# EAGLE design FX-Devcart_rev_A (EAGLE 9.6.2)
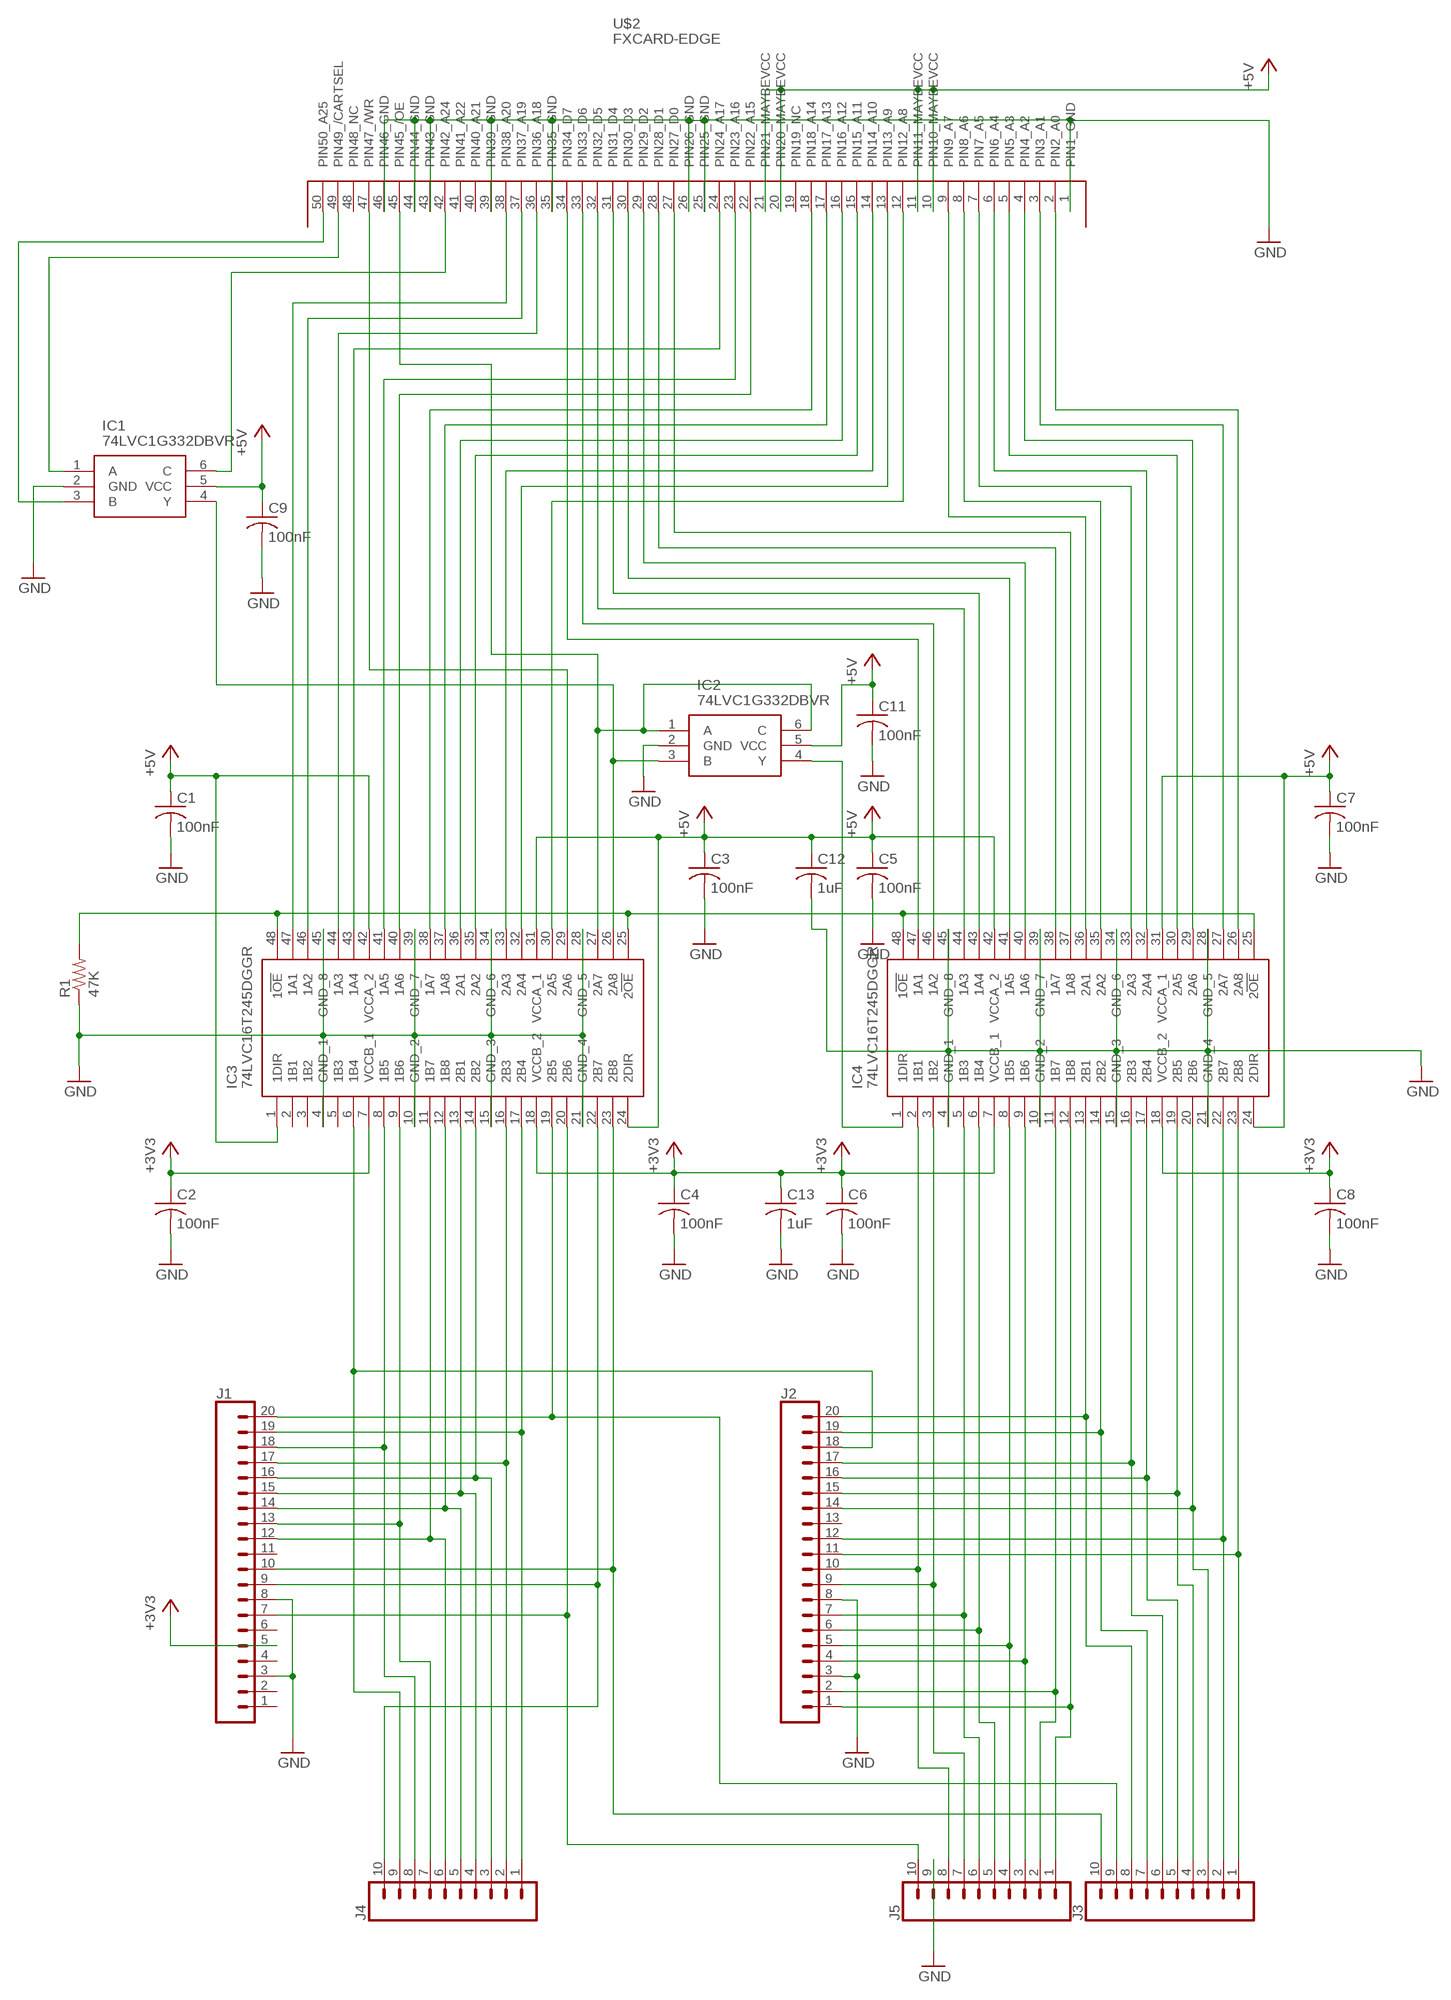
[diagram p0: schematic, sheet 1]

## Parts
C1  100nF  C-USC0402  [C0402]
C2  100nF  C-USC0402  [C0402]
C3  100nF  C-USC0402  [C0402]
C4  100nF  C-USC0402  [C0402]
C5  100nF  C-USC0402  [C0402]
C6  100nF  C-USC0402  [C0402]
C7  100nF  C-USC0402  [C0402]
C8  100nF  C-USC0402  [C0402]
C9  100nF  C-USC0402  [C0402]
C11  100nF  C-USC0402  [C0402]
C12  1uF  C-USC0402  [C0402]
C13  1uF  C-USC0402  [C0402]
IC1  74LVC1G332DBVR  [SOT95P280X145-6N]
IC2  74LVC1G332DBVR  [SOT95P280X145-6N]
IC3  74LVC16T245DGGR  [SOP50P810X120-48N]
IC4  74LVC16T245DGGR  [SOP50P810X120-48N]
J1  CONN_20NOSILK  [1X20_NOSILK]
J2  CONN_20NOSILK  [1X20_NOSILK]
J3  CONN_10NO_SILK_PTH_FEMALE  [1X10_NO_SILK]
J4  CONN_10NO_SILK_PTH_FEMALE  [1X10_NO_SILK]
J5  CONN_10NO_SILK_PTH_FEMALE  [1X10_NO_SILK]
R1  47K  R-US_R0402  [R0402]
U$2  FXCARD-EDGE  [FXCARD-EDGE]

## Nets
+3V3: C2.1 C4.1 C6.1 C8.1 C13.1 IC3.7(VCCB_1) IC3.18(VCCB_2) IC4.7(VCCB_1) IC4.18(VCCB_2) J1.5
+5V: C1.1 C3.1 C5.1 C7.1 C9.1 C11.1 C12.1 IC1.5(VCC) IC2.5(VCC) IC3.1(1DIR) IC3.24(2DIR) IC3.31(VCCA_1) IC3.42(VCCA_2) IC4.24(2DIR) IC4.31(VCCA_1) IC4.42(VCCA_2) U$2.10(PIN10_MAYBEVCC) U$2.11(PIN11_MAYBEVCC) U$2.20(PIN20_MAYBEVCC) U$2.21(PIN21_MAYBEVCC)
GND: C1.2 C2.2 C3.2 C4.2 C5.2 C6.2 C7.2 C8.2 C9.2 C11.2 C12.2 C13.2 IC1.2(GND) IC2.2(GND) IC3.4(GND_1) IC3.10(GND_2) IC3.15(GND_3) IC3.21(GND_4) IC3.28(GND_5) IC3.34(GND_6) IC3.39(GND_7) IC3.45(GND_8) IC4.4(GND_1) IC4.10(GND_2) IC4.15(GND_3) IC4.21(GND_4) IC4.28(GND_5) IC4.34(GND_6) IC4.39(GND_7) IC4.45(GND_8) J1.3 J1.8 J2.3 J2.8 J5.9 R1.1 U$2.1(PIN1_GND) U$2.25(PIN25_GND) U$2.26(PIN26_GND) U$2.35(PIN35_GND) U$2.39(PIN39_GND) U$2.43(PIN43_GND) U$2.44(PIN44_GND) U$2.46(PIN46_GND)
N$1: IC4.37(1A8) U$2.27(PIN27_D0)
N$2: IC4.38(1A7) U$2.28(PIN28_D1)
N$3: IC4.40(1A6) U$2.29(PIN29_D2)
N$4: IC4.41(1A5) U$2.30(PIN30_D3)
N$5: IC4.43(1A4) U$2.31(PIN31_D4)
N$6: IC4.44(1A3) U$2.32(PIN32_D5)
N$7: IC4.46(1A2) U$2.33(PIN33_D6)
N$8: IC4.47(1A1) U$2.34(PIN34_D7)
N$9: IC4.26(2A8) U$2.2(PIN2_A0)
N$10: IC4.27(2A7) U$2.3(PIN3_A1)
N$11: IC4.29(2A6) U$2.4(PIN4_A2)
N$12: IC4.30(2A5) U$2.5(PIN5_A3)
N$13: IC4.33(2A3) U$2.7(PIN7_A5)
N$14: IC3.43(1A4) U$2.24(PIN24_A17)
N$15: IC4.35(2A2) U$2.8(PIN8_A6)
N$16: IC4.36(2A1) U$2.9(PIN9_A7)
N$17: IC4.32(2A4) U$2.6(PIN6_A4)
N$18: IC3.44(1A3) U$2.36(PIN36_A18)
N$19: IC3.46(1A2) U$2.37(PIN37_A19)
N$20: IC3.47(1A1) U$2.38(PIN38_A20)
N$21: IC1.4(Y) IC2.3(B) IC3.26(2A8)
N$22: IC3.25(2!OE) IC3.48(1!OE) IC4.25(2!OE) IC4.48(1!OE) R1.2
N$23: IC4.23(2B8) J2.11 J3.1
N$24: IC4.22(2B7) J2.12 J3.2
N$25: IC4.20(2B6) J2.14 J3.3
N$26: IC2.4(Y) IC4.1(1DIR)
N$27: IC4.19(2B5) J2.15 J3.4
N$28: IC4.17(2B4) J2.16 J3.5
N$29: IC4.16(2B3) J2.17 J3.6
N$30: IC4.14(2B2) J2.19 J3.7
N$31: IC4.13(2B1) J2.20 J3.8
N$32: IC4.12(1B8) J2.1 J5.1
N$33: IC3.30(2A5) U$2.12(PIN12_A8)
N$34: IC3.32(2A4) U$2.13(PIN13_A9)
N$35: IC3.33(2A3) U$2.14(PIN14_A10)
N$36: IC3.35(2A2) U$2.15(PIN15_A11)
N$37: IC3.36(2A1) U$2.16(PIN16_A12)
N$38: IC3.37(1A8) U$2.17(PIN17_A13)
N$39: IC3.38(1A7) U$2.18(PIN18_A14)
N$40: IC3.40(1A6) U$2.22(PIN22_A15)
N$41: IC3.41(1A5) U$2.23(PIN23_A16)
N$42: IC3.29(2A6) U$2.47(PIN47_/WR)
N$43: IC2.1(A) IC2.6(C) IC3.27(2A7) U$2.45(PIN45_/OE)
N$44: IC1.3(B) U$2.50(PIN50_A25)
N$45: IC1.1(A) U$2.49(PIN49_/CARTSEL)
N$46: IC1.6(C) U$2.42(PIN42_A24)
N$47: IC4.11(1B7) J2.2 J5.2
N$48: IC4.9(1B6) J2.4 J5.3
N$49: IC4.8(1B5) J2.5 J5.4
N$50: IC4.6(1B4) J2.6 J5.5
N$51: IC4.5(1B3) J2.7 J5.6
N$52: IC4.3(1B2) J2.9 J5.7
N$53: IC3.20(2B6) J1.7 J5.10
N$54: IC3.19(2B5) J1.20 J3.9
N$55: IC3.17(2B4) J1.19 J4.1
N$56: IC3.16(2B3) J1.17 J4.2
N$57: IC3.14(2B2) J1.16 J4.3
N$58: IC3.13(2B1) J1.15 J4.4
N$59: IC3.12(1B8) J1.14 J4.5
N$60: IC3.11(1B7) J1.12 J4.6
N$61: IC3.9(1B6) J1.13 J4.7
N$62: IC3.8(1B5) J1.18 J4.8
N$63: IC3.6(1B4) J2.18 J4.9
N$65: IC3.22(2B7) J1.9 J4.10
N$70: IC3.23(2B8) J1.10 J3.10
N$71: IC4.2(1B1) J2.10 J5.8
Unconnected: IC3.2(1B1) IC3.3(1B2) IC3.5(1B3) J1.1 J1.2 J1.4 J1.6 J1.11 J2.13 U$2.19(PIN19_NC) U$2.40(PIN40_A21) U$2.41(PIN41_A22) U$2.48(PIN48_NC)

## Library data of the parts
C1-C9 C11-C13 = PC-Engine0402:C-US: CAPACITOR, American symbol
IC1 IC2 = PC-Engine:74LVC1G332DBVR: Texas Instruments 74LVC1G332DBVR, 3-Input OR Logic Gate, 1.65 5.5 V, 6-Pin SOT-23 Source: Datasheet <http://www.ti.com/general/docs/suppproductinfo.tsp?distId=26&gotoUrl=http://www.ti.com/lit/gpn/sn74lvc1g332>; DESCRIPTION: Texas Instruments 74LVC1G332DBVR, 3-Input OR Logic Gate, 1.65 5.5 V, 6-Pin SOT-23; HEIGHT: 1.45mm; MANUFACTURER_NAME: Texas Instruments; MANUFACTURER_PART_NUMBER: 74LVC1G332DBVR
IC3 IC4 = PC-Engine:74LVC16T245DGGR: Texas Instruments 74LVC16T245DGGR, Dual, Bus Transceiver, 16-Bit Non-Inverting LVTTL, 1.65 5.5 V, 48-Pin TSSOP Source: Datasheet <https://www.ti.com/lit/ds/symlink/sn74lvc16t245.pdf?ts=1617777001037&ref_url=https%3A%2F%2Fwww.google.com%2F>; DESCRIPTION: Texas Instruments 74LVC16T245DGGR, Dual, Bus Transceiver, 16-Bit Non-Inverting LVTTL, 1.65 5.5 V, 48-Pin TSSOP; HEIGHT: 1.2mm; MANUFACTURER_NAME: Texas Instruments; MANUFACTURER_PART_NUMBER: 74LVC16T245DGGR
J1 J2 = SparkFun-Connectors:CONN_20: Multi connection point. Often used as Generic Header-pin footprint for 0.1 inch spaced/style header connections On any of the 0.1 inch spaced packages, you can populate with these: Break Away Headers - Straight <https://www.sparkfun.com/products/116> (PRT-00116) Break Away Male Headers - Right Angle <https://www.sparkfun.com/products/553> (PRT-00553) Female Headers <https://www.sparkfun.com/products/115> (PRT-00115) Break Away Headers - Machine Pin <https://www.sparkfun.com/products/117> (PRT-00117) Break Away Female Headers - Swiss Machine Pin <https://www.sparkfun.com/products/743> (PRT-00743) For SCREWTERMINALS and SPRING TERMINALS visit here: Screw Terimnals on SparkFun.com <https://www.sparkfun.com/search/results?term=Screw+Terminals> (5mm/3.5mm/2.54mm spacing) This device is also useful as a general connection point to wire up your design to another part of your project. Our various solder wires solder well into these plated through hole pads. Hook-Up Wire - Assortment (Stranded, 22 AWG) <https://www.sparkfun.com/products/11375> (PRT-11375) Hook-Up Wire - Assortment (Solid Core, 22 AWG) <https://www.sparkfun.com/products/11367> (PRT-11367) View the entire wire category on our website here <https://www.sparkfun.com/categories/141> Special notes: Molex polarized connector foot print use with SKU : PRT-08231 with associated crimp pins and housings. 1MM SMD Version SKU: PRT-10208 NOTES ON THE VARIANTS LOCK and LOCK_LONGPADS... This footprint was designed to help hold the alignment of a through-hole component (i.e. 6-pin header) while soldering it into place. You may notice that each hole has been shifted either up or down by 0.005 of an inch from it's more standard position (which is a perfectly straight line). This slight alteration caused the pins (the squares in the middle) to touch the edges of the holes. Because they are alternating, it causes a "brace" to hold the component in place. 0.005 has proven to be the perfect amount of "off-center" position when using our standard breakaway headers. Although looks a little odd when you look at the bare footprint, once you have a header in there, the alteration is very hard to notice. Also,if you push a header all the way into place, it is covered up entirely on the bottom side. Note about LOCK SPECIAL package: This is just like the LOCK variant in that the holes are staggared by 5 mil, but except for the last two holes. They are not altered from the "standard" footprint layout. This is used for a special purpose on the layout of our Graphic LCD Backpack. Make sure you want to use this device before selecting it for you project!
J3-J5 = SparkFun-Connectors_new:CONN_10: Multi connection point. Often used as Generic Header-pin footprint for 0.1 inch spaced/style header connections On any of the 0.1 inch spaced packages, you can populate with these: Break Away Headers - Straight <https://www.sparkfun.com/products/116> (PRT-00116) Break Away Male Headers - Right Angle <https://www.sparkfun.com/products/553> (PRT-00553) Female Headers <https://www.sparkfun.com/products/115> (PRT-00115) Break Away Headers - Machine Pin <https://www.sparkfun.com/products/117> (PRT-00117) Break Away Female Headers - Swiss Machine Pin <https://www.sparkfun.com/products/743> (PRT-00743) Arduino Stackable Header - 10 Pin <https://www.sparkfun.com/products/11376> (PRT-11376) For SCREWTERMINALS and SPRING TERMINALS visit here: Screw Terimnals on SparkFun.com <https://www.sparkfun.com/search/results?term=Screw+Terminals> (5mm/3.5mm/2.54mm spacing) This device is also useful as a general connection point to wire up your design to another part of your project. Our various solder wires solder well into these plated through hole pads. Hook-Up Wire - Assortment (Stranded, 22 AWG) <https://www.sparkfun.com/products/11375> (PRT-11375) Hook-Up Wire - Assortment (Solid Core, 22 AWG) <https://www.sparkfun.com/products/11367> (PRT-11367) View the entire wire category on our website here <https://www.sparkfun.com/categories/141> Special notes: Molex polarized connector foot print use with SKU : PRT-08231 with associated crimp pins and housings. 1MM SMD Version SKU: PRT-10208 NOTES ON THE VARIANTS LOCK and LOCK_LONGPADS... This footprint was designed to help hold the alignment of a through-hole component (i.e. 6-pin header) while soldering it into place. You may notice that each hole has been shifted either up or down by 0.005 of an inch from it's more standard position (which is a perfectly straight line). This slight alteration caused the pins (the squares in the middle) to touch the edges of the holes. Because they are alternating, it causes a "brace" to hold the component in place. 0.005 has proven to be the perfect amount of "off-center" position when using our standard breakaway headers. Although looks a little odd when you look at the bare footprint, once you have a header in there, the alteration is very hard to notice. Also,if you push a header all the way into place, it is covered up entirely on the bottom side.; PROD_ID: CONN-11563
R1 = PC-Engine0402:R-US_: RESISTOR, American symbol
U$2 = PC-Engine:FXCARD-EDGE

## Board
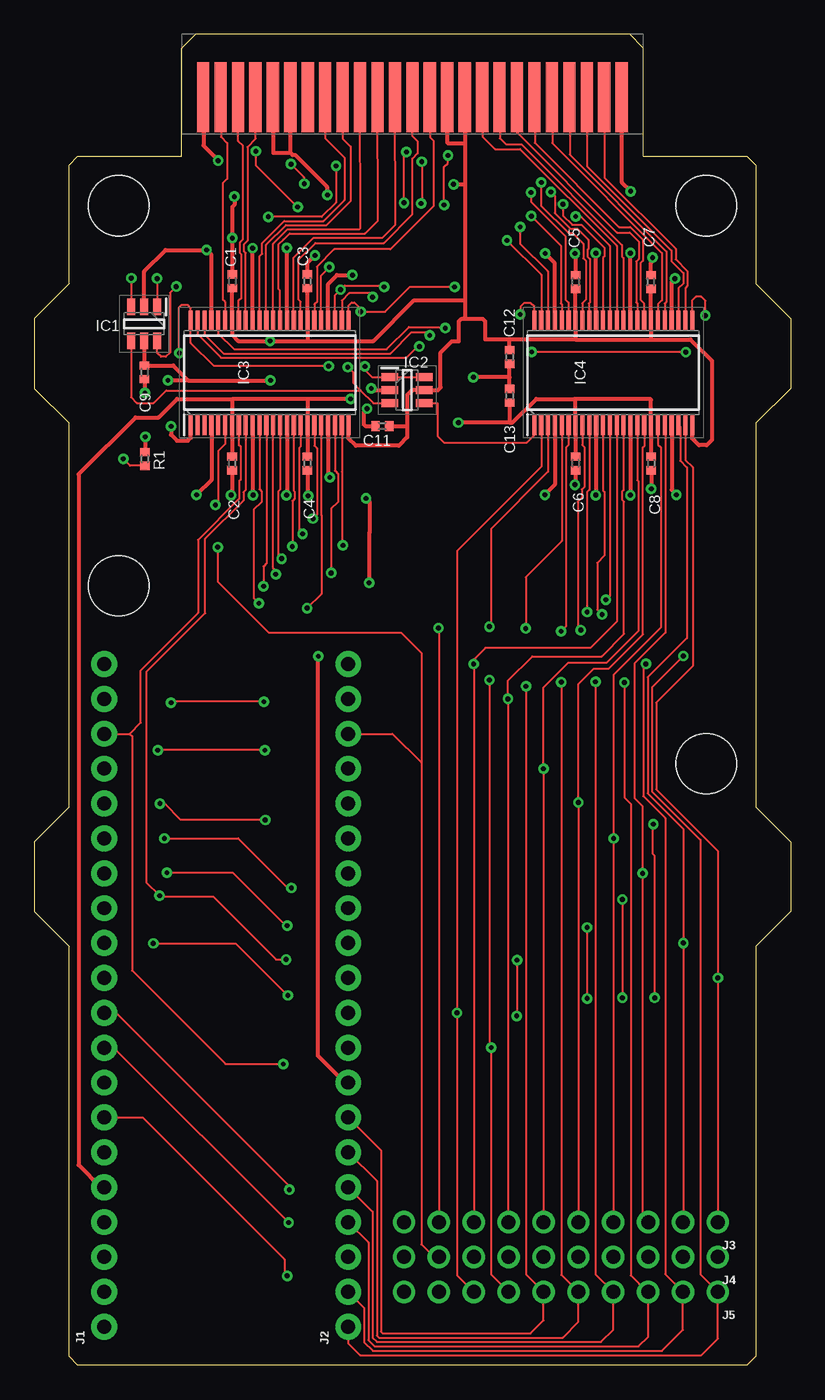
[diagram p1: board, top side]
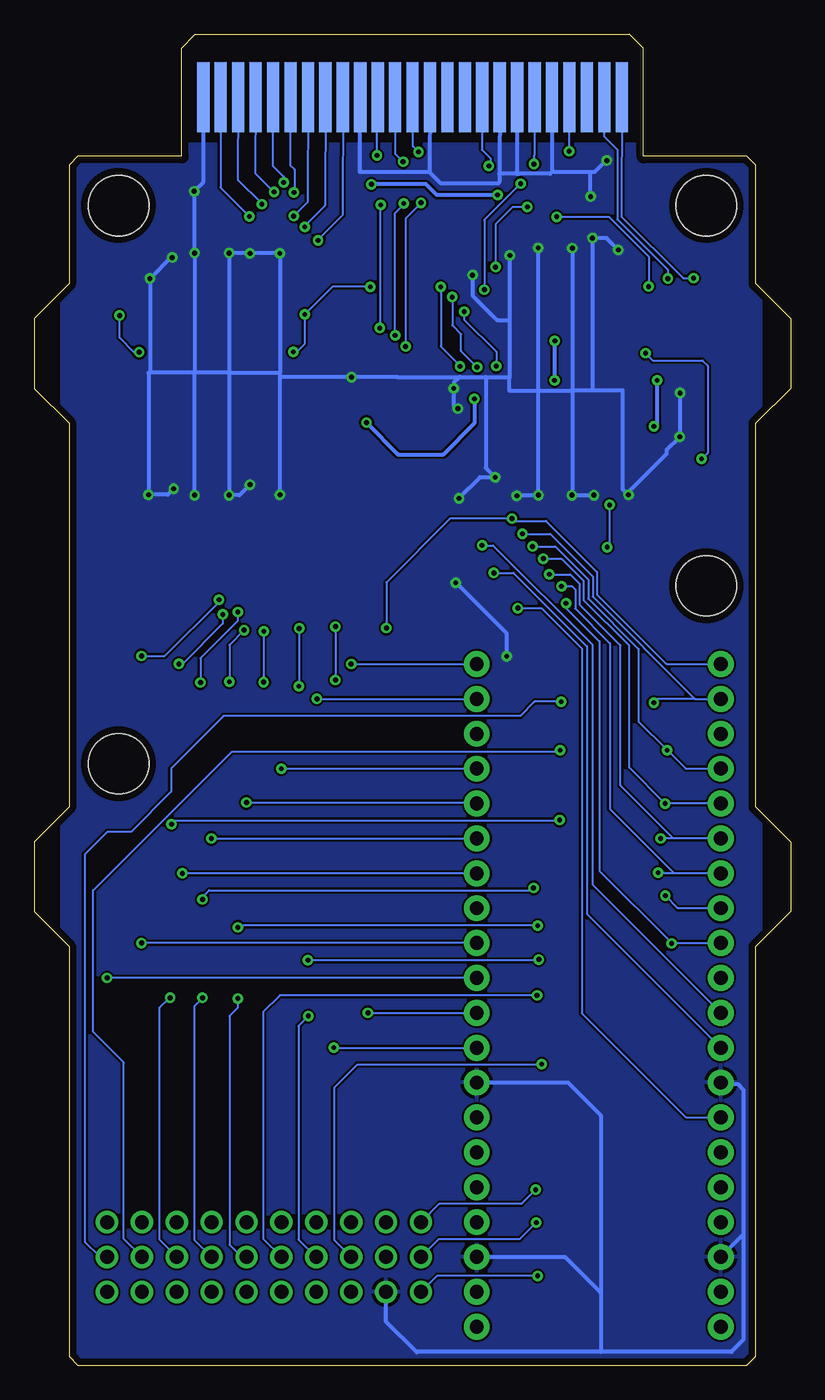
[diagram p2: board, bottom side, seen from below]

Size 55.08 x 96.9 mm. Coordinates in mm from the lower left corner, seen from the top.
Outline: 52.54,87.38 52.54,78.74 55.08,76.2 55.08,71.12 52.54,68.58 52.54,40.64 55.08,38.1 55.08,33.02 52.54,30.48 52.54,0.64 51.91,0 3.17,0 2.54,0.64 2.54,30.48 0,33.02 0,38.1 2.54,40.64 2.54,68.58 0,71.12 0,76.2 2.54,78.74 2.54,87.38 3.17,88.01 10.72,88.01 10.72,95.9 11.74,96.9 43.37,96.9 44.35,95.9 44.35,88.01 51.91,88.01 52.54,87.38
Copper layers (1*16): Top 0.035mm / dielectric 1.5mm / Bottom 0.035mm
Design rules "default *": minimum track width 6mil, minimum drill 0.35mm, track to track 6mil, track to pad 6mil, pad to pad 6mil, via to via 6mil, smd to smd 6mil, copper to edge 20mil, drill to drill 6mil, minimum pad ring 10mil, minimum via ring 8mil, stop-mask expansion 2mil, vias tented up to drill 15mil, thermal gap 10mil
Holes 4.4 mm at 6.14,84.43 48.94,84.43 6.14,56.74 48.94,43.79

### Footprints (pad centres in the part's own frame; a part is rotated, then mirrored left to right if it is on the bottom)
C0402 = smd 0.6 x 0.7: 1 -0.5,0; 2 0.5,0
SOT95P280X145-6N = smd 1.2 x 0.6: 1 -1.25,0.95; 2 -1.25,0; 3 -1.25,-0.95; 4 1.25,-0.95; 5 1.25,0; 6 1.25,0.95
SOP50P810X120-48N = smd 1.475 x 0.3: 1 -3.788,5.75; 2 -3.788,5.25; 3 -3.788,4.75; 4 -3.788,4.25; 5 -3.788,3.75; 6 -3.788,3.25; 7 -3.788,2.75; 8 -3.788,2.25; 9 -3.788,1.75; 10 -3.788,1.25; 11 -3.788,0.75; 12 -3.788,0.25; 13 -3.788,-0.25; 14 -3.788,-0.75; 15 -3.788,-1.25; 16 -3.788,-1.75; 17 -3.788,-2.25; 18 -3.788,-2.75; 19 -3.788,-3.25; 20 -3.788,-3.75; 21 -3.788,-4.25; 22 -3.788,-4.75; 23 -3.788,-5.25; 24 -3.788,-5.75; 25 3.788,-5.75; 26 3.788,-5.25; 27 3.788,-4.75; 28 3.788,-4.25; 29 3.788,-3.75; 30 3.788,-3.25; 31 3.788,-2.75; 32 3.788,-2.25; 33 3.788,-1.75; 34 3.788,-1.25; 35 3.788,-0.75; 36 3.788,-0.25; 37 3.788,0.25; 38 3.788,0.75; 39 3.788,1.25; 40 3.788,1.75; 41 3.788,2.25; 42 3.788,2.75; 43 3.788,3.25; 44 3.788,3.75; 45 3.788,4.25; 46 3.788,4.75; 47 3.788,5.25; 48 3.788,5.75
1X20_NOSILK = drill 1.016 pad 1.88: 1 0,0; 2 2.54,0; 3 5.08,0; 4 7.62,0; 5 10.16,0; 6 12.7,0; 7 15.24,0; 8 17.78,0; 9 20.32,0; 10 22.86,0; 11 25.4,0; 12 27.94,0; 13 30.48,0; 14 33.02,0; 15 35.56,0; 16 38.1,0; 17 40.64,0; 18 43.18,0; 19 45.72,0; 20 48.26,0
1X10_NO_SILK = drill 1.016 pad 1.626: 1 0,0; 2 2.54,0; 3 5.08,0; 4 7.62,0; 5 10.16,0; 6 12.7,0; 7 15.24,0; 8 17.78,0; 9 20.32,0; 10 22.86,0
R0402 = smd 0.6 x 0.7: 1 -0.5,0; 2 0.5,0
FXCARD-EDGE = smd 0.889 x 5.08: 1 32.055,-4.572; 2 30.785,-4.572; 3 29.515,-4.572; 4 28.245,-4.572; 5 26.975,-4.572; 6 25.705,-4.572; 7 24.435,-4.572; 8 23.165,-4.572; 9 21.895,-4.572; 10 20.625,-4.572; 11 19.355,-4.572; 12 18.085,-4.572; 13 16.815,-4.572; 14 15.545,-4.572; 15 14.275,-4.572; 16 13.005,-4.572; 17 11.735,-4.572; 18 10.465,-4.572; 19 9.195,-4.572; 20 7.925,-4.572; 21 6.655,-4.572; 22 5.385,-4.572; 23 4.115,-4.572; 24 2.845,-4.572; 25 1.575,-4.572 | smd 0.889 x 5.08 bottom: 26 32.055,-4.572; 27 30.785,-4.572; 28 29.515,-4.572; 29 28.245,-4.572; 30 26.975,-4.572; 31 25.705,-4.572; 32 24.435,-4.572; 33 23.165,-4.572; 34 21.895,-4.572; 35 20.625,-4.572; 36 19.355,-4.572; 37 18.085,-4.572; 38 16.815,-4.572; 39 15.545,-4.572; 40 14.275,-4.572; 41 13.005,-4.572; 42 11.735,-4.572; 43 10.465,-4.572; 44 9.195,-4.572; 45 7.925,-4.572; 46 6.655,-4.572; 47 5.385,-4.572; 48 4.115,-4.572; 49 2.845,-4.572; 50 1.575,-4.572

### Placement (x,y rotation side)
C1  14.43,78.92 90 top
C2  14.4,65.66 270 top
C3  19.89,78.92 90 top
C4  19.89,65.66 270 top
C5  39.42,78.87 90 top
C6  39.42,65.66 270 top
C7  44.91,78.87 90 top
C8  44.93,65.66 270 top
C9  8.03,72.29 270 top
C11  25.35,68.38 180 top
C12  34.62,73.41 270 top
C13  34.62,70.59 90 top
IC1  8,75.82 270 top
IC2  27.15,70.99 0 top
IC3  17.14,72.26 90 top
IC4  42.16,72.26 90 top
J1  5.08,2.79 90 top
J2  22.86,2.79 90 top
J3  49.78,10.41 180 top
J4  49.78,7.87 180 top
J5  49.78,5.33 180 top
R1  8.05,65.99 270 top
U$2  10.72,96.9 0 top

### Tracks (layer width: path | path; a pad name or v marks a point on that pad's centre or on a via)
+3V3  (via drill 0.35)
  Top 0.305: 34.62,68.63 34.82,68.63 36.55,70.36 39.37,70.36 39.38,70.35 | 39.38,70.35 44.84,70.35 44.91,70.28 IC4.18 44.91,66.18 C8.1 | 39.38,70.35 39.41,70.31 IC4.7 C6.1 | v23.04,70.36 19.96,70.36 | 34.62,68.63 v30.89,68.63 | 19.96,70.36 19.89,70.29 IC3.18 C4.1 | 19.96,70.36 14.45,70.36 | 14.45,70.36 14.39,70.3 IC3.7 C2.1 | C13.1 34.62,68.63 | J1.5 4.85,12.95 3.23,14.58 3.23,64.87 7.37,69.01 9.05,69.01 10.39,70.36 14.45,70.36
  Bottom 0.305: v30.89,68.63 28.57,66.32 25.3,66.32 23.04,68.58 v23.04,70.36
+5V  (via drill 0.35)
  Top 0.305: U$2.10 31.37,88.98 | 31.37,88.98 30.1,88.98 U$2.11 | U$2.21 17.4,88.27 18.67,88.27 | 18.67,88.27 U$2.20 | 19.89,74.57 v17.17,74.57 14.85,74.57 14.39,75.03 IC3.42 14.39,78.39 C1.1 | 19.89,74.57 24.69,74.57 27.66,77.55 31.37,77.55 | 31.27,76.2 31.11,76.2 30.93,76.01 30.93,74.55 30.4,74.55 29.59,73.74 29.59,71.2 29.39,70.99 IC2.5 27.51,70.99 27.15,70.64 27.15,68.38 | 31.27,76.2 32.64,76.2 32.83,76.01 32.83,74.68 34.62,74.68 | 39.41,74.68 IC4.42 C5.1 | 39.41,74.68 34.62,74.68 | 44.91,74.68 IC4.31 C7.1 | 39.41,74.68 44.91,74.68 | IC4.24 47.91,67.48 48.41,66.98 48.97,66.98 49.35,67.36 49.35,73.13 49.33,73.13 47.78,74.68 44.91,74.68 | 31.37,88.98 31.37,86.03 | 31.37,86.03 31.37,77.55 | 31.37,77.55 31.37,76.3 31.27,76.2 | C3.1 IC3.31 19.89,74.58 19.89,74.57 | IC1.5 8,72.81 C9.1 10.12,72.79 11.2,71.7 | 18.67,88.27 18.8,88.14 18.98,88.14 21.31,85.8 21.31,85.24 v21.35,85.2 | v30.53,85.98 31.32,85.98 31.37,86.03 | 11.2,71.7 v17.2,71.7 | C12.1 34.62,74.68 | IC3.24 22.89,67.48 23.42,66.95 26.54,66.95 27.15,67.56 27.15,68.38 | 11.2,71.7 9.91,71.7 v9.73,71.7 | v9.96,68.35 9.96,67.74 10.39,67.31 11.18,67.31 11.39,67.53 IC3.1 | C11.1 27.15,68.38
  Bottom 0.305: v21.35,85.2 25.77,85.2 26.57,86 30.5,86 v30.53,85.98 | v17.2,71.7 17.2,74.55 v17.17,74.57 | v9.73,71.7 9.73,68.58 v9.96,68.35
GND  (via drill 0.35)
  Top 0.305: v43.43,85.47 42.8,86.11 U$2.1 | U$2.25 12.32,88.8 13.39,87.73 v13.39,87.71 | IC4.21 46.41,63.72 v46.76,63.37 | IC4.15 v43.41,63.35 | IC4.45 37.91,80.23 v37.2,80.95 | IC4.39 40.91,80.95 v40.89,80.97 | IC4.34 v43.41,80.97 | IC4.28 46.41,78.88 v46.66,79.12 | IC4.4 37.91,64.11 37.19,63.38 37.18,63.38 v37.19,63.37 | IC4.10 40.91,63.37 v40.89,63.35 | C7.2 44.91,80.26 45.06,80.42 45.06,80.62 v45.03,80.64 | v39.37,80.95 39.42,80.9 C5.2 | v39.37,64.11 39.42,64.16 C6.2 | C8.2 v44.93,63.8 | IC3.28 21.39,78.72 22.05,79.38 v23.16,79.38 | IC3.21 21.39,64.76 v21.51,64.64 | IC3.15 18.39,63.38 v18.36,63.35 | IC3.34 v18.39,81.35 v18.39,81.36 | IC3.39 v15.89,81.33 v15.9,81.33 | IC3.10 15.89,63.38 v15.93,63.35 | IC3.4 12.89,64.46 v11.81,63.37 | IC3.45 12.89,80.86 v12.55,81.2 9.55,81.2 8,79.65 IC1.2 | C3.2 19.89,80.26 20.42,80.8 v20.45,80.8 | C1.2 v14.43,82.07 14.43,84.33 14.58,84.48 v14.58,85.08 v14.57,85.08 | v24.54,71.12 24.66,70.99 IC2.2 | C13.2 34.62,71.93 | 34.62,71.93 C12.2 | 34.62,71.93 v31.98,71.93 | C2.2 14.4,63.35 v14.32,63.35 | C4.2 19.89,63.35 v19.94,63.3 | C9.2 8.05,71.76 v8.05,70.79 | v8.08,67.59 8.08,66.52 R1.1 | v24.23,69.65 23.98,69.39 23.98,68.5 24.11,68.38 C11.2 | v24.16,63.12 24.41,62.87 24.41,60.6 24.38,60.58 v24.38,56.97 | v20.68,51.61 20.65,51.61 20.65,22.53 22.61,20.57 J2.8
  Bottom 0.305: U$2.39 26.29,86.87 | 26.29,86.87 31.37,86.87 U$2.35 | U$2.44 19.94,86.87 | 19.94,86.87 19.94,86.74 21.21,86.74 | U$2.43 21.21,86.74 | U$2.46 17.4,86.87 | 17.4,86.87 17.53,86.74 19.81,86.74 19.94,86.87 | U$2.1 42.8,86.11 v43.43,85.47 43.41,85.45 v43.41,80.97 43.41,72.26 | 40.92,72.26 40.89,72.26 v40.89,80.97 39.4,80.97 v39.37,80.95 v37.2,80.95 37.2,72.26 37.19,72.25 | 40.92,72.26 43.41,72.26 | 43.41,72.26 46.66,72.26 | 46.66,72.26 46.76,72.26 v46.76,63.37 45.36,63.37 v44.93,63.8 | 46.66,72.26 v46.66,79.12 45.09,80.7 v45.03,80.64 | 40.91,72.25 40.92,72.26 | v43.41,63.35 43.41,72.26 | 40.91,72.25 40.91,63.36 v40.89,63.35 40.13,63.35 v39.37,64.11 | 31.97,71.94 37.19,71.94 | 37.19,72.25 40.91,72.25 | v37.19,63.37 37.19,71.94 | 37.19,71.94 37.19,72.25 | 24.11,71.96 28.65,71.96 28.66,71.94 31.97,71.94 | 24.11,71.96 22.2,71.96 22.2,71.93 | 22.2,71.93 20.5,71.93 | 20.5,71.93 20.47,71.93 20.47,76.12 | 18.39,70.97 20.5,70.97 20.5,71.93 | 18.39,70.97 18.36,70.97 | 18.36,70.97 15.9,70.97 | 22.2,71.93 22.2,65.33 v21.51,64.64 22.63,64.64 v24.16,63.12 | 18.36,70.97 v18.36,63.35 19.89,63.35 v19.94,63.3 | v18.39,81.36 18.39,70.97 | v15.9,81.33 15.9,70.97 | 15.9,70.97 15.9,63.37 v15.93,63.35 v14.32,63.35 | 14.45,70.97 12.24,70.97 12.24,63.8 v11.81,63.37 11.81,63.58 9.04,66.34 9.04,66.62 v8.08,67.59 8.08,70.76 v8.05,70.79 | 14.45,70.97 15.9,70.97 | v20.45,80.8 20.47,80.77 20.47,76.12 | v23.16,79.38 23.16,77.88 21.39,76.1 20.5,76.1 20.47,76.12 | 14.45,70.97 14.45,82.04 v14.43,82.07 13.41,82.07 v12.55,81.2 | 24.11,71.96 24.54,71.53 v24.54,71.12 24.54,69.9 24.29,69.65 v24.23,69.65 | 21.21,86.74 21.21,86.13 21.31,86.03 25.45,86.03 26.29,86.87
  Bottom 0.305: v13.39,87.71 13.44,87.71 14.28,86.87 14.58,86.87 | 14.58,86.87 17.4,86.87 | v14.57,85.08 14.58,85.09 14.58,86.87 | J1.8 4.98,20.47 3.86,20.47 3.43,20.04 3.43,9.53 | J1.3 3.43,9.53 | 3.43,9.53 3.43,1.85 4.32,0.96 13.82,0.96 | J5.9 29.46,3.17 27.22,0.93 27.18,0.96 13.82,0.96 | J2.3 16.43,7.87 13.82,5.26 | 13.82,5.26 13.82,0.96 | J2.8 16.2,20.57 13.82,18.19 13.82,5.26 | v20.68,51.61 20.68,53.26 v24.38,56.97 | v31.98,71.93 31.97,71.94
  pour Bottom: 2.18,-0.2 2.18,88.39 1.7,88.87 52.68,88.87 53.09,88.47 53.09,0 52.98,-0.1 2.29,-0.1
N$1  (via drill 0.35)
  Top 0.152: v39.42,83.64 39.77,83.64 41.91,81.5 IC4.37
  Bottom 0.152: U$2.27 41.53,85.75 v39.42,83.64
N$2  (via drill 0.35)
  Top 0.152: v38.51,84.53 38.51,83.7 39.17,83.04 39.85,83.04 41.5,81.38 41.5,80.72 41.41,80.64 IC4.38
  Bottom 0.152: U$2.28 40.26,86.31 38.51,84.56 v38.51,84.53
N$3  (via drill 0.35)
  Top 0.152: v37.62,85.42 37.9,85.14 37.9,83.88 39.05,82.73 39.54,82.73 40.34,81.94 40.34,81.28 40.29,81.23 40.29,80.72 40.46,80.55 40.46,77.37 40.39,77.29 40.39,76.08 IC4.40
  Bottom 0.152: U$2.29 38.99,86.79 v37.62,85.42
N$4  (via drill 0.35)
  Top 0.152: IC4.41 39.91,77.33 40.16,77.57 40.16,80.42 39.98,80.6 39.98,81.66 39.21,82.43 38.92,82.43 36.91,84.44 36.91,86.11 v36.92,86.12
  Bottom 0.152: U$2.30 37.72,87.35 36.92,86.55 v36.92,86.12
N$5  (via drill 0.35)
  Top 0.152: v36.17,85.39 36.17,84.71 38.69,82.19 38.69,77.59 38.91,77.37 IC4.43
  Bottom 0.152: U$2.31 36.45,87.38 36.14,87.07 36.14,85.55 36.17,85.52 v36.17,85.39
N$6  (via drill 0.35)
  Top 0.152: v36.2,83.67 38.34,81.53 38.34,77.32 38.41,77.25 IC4.44
  Bottom 0.152: U$2.32 35.18,84.68 v36.2,83.67
N$7  (via drill 0.35)
  Top 0.152: v35.38,82.88 35.38,81.66 37.39,79.65 37.39,76.08 IC4.46
  Bottom 0.152: U$2.33 33.91,84.43 35.41,82.93 35.41,82.91 v35.38,82.88
N$8  (via drill 0.35)
  Top 0.152: v34.42,81.89 36.91,79.39 IC4.47
  Bottom 0.152: U$2.34 32.64,83.72 34.42,81.94 v34.42,81.89
N$9
  Top 0.152: IC4.26 47.41,78.44 47.57,78.59 47.57,79.65 46.71,80.52 46.71,81.28 41.53,86.46 U$2.2
N$10
  Top 0.152: U$2.3 40.26,87.3 46.41,81.15 46.41,80.39 47.27,79.53 47.27,78.77 46.91,78.41 IC4.27 | IC4.27
N$11
  Top 0.152: U$2.4 38.99,88.14 46.03,81.09 46.03,77.43 45.91,77.31 IC4.29
N$12
  Top 0.152: U$2.5 37.72,88.98 45.72,80.98 45.72,77.55 45.41,77.24 IC4.30
N$13
  Top 0.152: U$2.7 35.18,89.74 42.44,82.47 43.36,82.47 44.02,81.82 44.02,80.54 43.84,80.37 43.84,77.39 43.92,77.32 IC4.33
N$14
  Top 0.152: U$2.24 13.59,89.43 14.05,88.98 14.05,86.38 13.72,86.06 13.72,77.6 13.89,77.42 IC3.43
N$15
  Top 0.152: U$2.8 33.91,89.33 34.35,88.89 35.47,88.89 42.8,81.56 42.8,80.72 42.91,80.61 IC4.35
N$16
  Top 0.152: U$2.9 32.64,89.46 33.55,88.54 35.38,88.54 42.42,81.51 IC4.36
N$17
  Top 0.152: U$2.6 36.45,89 42.58,82.87 43.4,82.87 44.32,81.94 44.32,80.41 44.15,80.24 44.15,77.57 44.39,77.32 44.39,76.07 IC4.32
N$18  (via drill 0.35)
  Top 0.152: IC3.44 13.39,75.12 14.55,73.97 25.65,73.97 27.28,75.59 29.9,75.59 29.92,75.56 v29.92,75.52 | v29.84,84.48 29.84,87.25 30.12,87.53 v30.12,88.09
  Bottom 0.152: v29.92,75.52 29.9,75.54 29.9,84.43 v29.84,84.48 | v30.12,88.09 30.12,92.3 U$2.36
N$19  (via drill 0.35)
  Top 0.152: IC3.46 12.39,75.04 13.77,73.66 25.93,73.66 27.48,75.21 28.58,75.21 v28.8,74.98 | v28.17,84.59 28.22,84.64 v28.22,87.63
  Bottom 0.152: v28.8,74.98 28.8,83.9 28.17,84.53 v28.17,84.59 | v28.22,87.63 28.8,88.21 U$2.37
N$20  (via drill 0.35)
  Top 0.152: IC3.47 11.89,75.07 13.6,73.36 27.1,73.36 27.91,74.17 v28.04,74.17 | v26.92,84.63 26.92,88.34 v27.1,88.34
  Bottom 0.152: v28.04,74.17 28.04,83.49 26.92,84.61 v26.92,84.63 | v27.1,88.34 27.51,88.75 27.51,92.28 U$2.38
N$21  (via drill 0.35)
  Top 0.152: IC1.4 7.05,70.47 7.47,70.05 8.69,70.05 9.6,70.97 23.77,70.97 | 23.77,70.97 23.22,71.53 23.22,72.29 v22.84,72.67 | 23.77,70.97 24.7,70.04 IC2.3 | IC3.26 22.39,77.51 22.94,78.05 24.51,78.05 24.64,77.93 v24.64,77.78
  Bottom 0.152: v22.84,72.67 24,73.84 24,75.08 24.64,75.72 v24.64,77.78
N$22  (via drill 0.35)
  Top 0.152: IC3.25 22.89,77.15 23.11,77.37 23.32,77.37 23.77,76.91 v23.77,76.71 25.55,76.71 27.36,78.51 v30.61,78.51 | v21.44,72.75 13.08,72.75 11.39,74.43 IC3.48 11.39,76.97 11.2,77.17 10.69,77.17 10.52,76.99 10.52,73.74 v10.57,73.69 | IC4.48 36.41,77.07 36.14,77.34 35.66,77.34 35.41,77.09 35.41,76.53 v35.38,76.5 | v47.45,73.76 47.42,73.79 v36.22,73.79 | IC4.25 47.9,76.06 47.9,77.52 48.18,77.8 48.56,77.8 48.87,77.5 v48.87,76.43 | R1.2 6.98,65.49 v6.48,65.99
  Bottom 0.152: v23.77,76.71 23.77,76.12 21.44,73.79 v21.44,72.75 | v10.57,73.69 10.03,73.15 6.43,73.15 6.04,72.77 6.04,66.42 v6.48,65.99 | v36.22,73.79 35.94,73.79 35.38,74.35 v35.38,76.5 33.38,78.51 v30.61,78.51 | v47.45,73.76 47.83,73.76 48.87,74.8 v48.87,76.43
N$23  (via drill 0.35)
  Top 0.152: IC4.23 47.41,65.91 47.95,65.38 47.95,50.89 45.29,48.23 45.29,41.94 49.78,37.44 v49.78,28.19 J3.1
  Bottom 0.152: J2.11 v49.78,28.19
N$24  (via drill 0.35)
  Top 0.152: IC4.22 47.03,68.35 47.03,65.86 47.52,65.37 47.52,52.93 44.68,50.09 44.68,41.63 47.27,39.04 v47.27,30.73 47.27,10.44 J3.2
  Bottom 0.152: J2.12 v47.27,30.73
N$25  (via drill 0.35)
  Top 0.152: IC4.20 45.97,68.42 45.97,53.33 43.71,51.08 43.71,41.3 44.3,40.72 v44.3,35.81 44.3,10.64 44.53,10.41 J3.3
  Bottom 0.152: J2.14 v44.3,35.81
N$26
  Top 0.152: IC2.4 29.36,70.04 29.36,67.64 29.82,67.18 35.87,67.18 36.41,67.73 IC4.1
N$27  (via drill 0.35)
  Top 0.152: IC4.19 45.41,67.03 45.62,66.83 45.62,53.69 42.19,50.27 v42.19,38.35 42.19,10.44 J3.4
  Bottom 0.152: v42.19,38.35 J2.15
N$28  (via drill 0.35)
  Top 0.152: IC4.17 44.41,66.92 44.33,66.83 44.33,53.22 41.83,50.72 40.77,50.72 39.62,49.58 v39.62,40.97 J3.5
  Bottom 0.152: v39.62,40.97 22.94,40.97 J2.16
N$29  (via drill 0.35)
  Top 0.152: IC4.16 43.91,64.44 44.02,64.34 44.02,53.49 41.68,51.16 38.89,51.16 37.08,49.35 v37.08,43.43 J3.6
  Bottom 0.152: v37.08,43.43 J2.17
N$30  (via drill 0.35)
  Top 0.152: IC4.14 42.91,63.71 42.8,63.6 42.8,63.02 42.95,62.87 42.95,53.24 41.33,51.61 36.27,51.61 34.49,49.84 v34.49,48.51 34.49,10.46 J3.7
  Bottom 0.152: v34.49,48.51 J2.19
N$31  (via drill 0.35)
  Top 0.152: IC4.13 42.44,68.45 42.44,54.15 40.51,52.22 32.84,52.22 32,51.38 v32,51.05 J3.8
  Bottom 0.152: v32,51.05 J2.20
N$32  (via drill 0.35)
  Top 0.152: IC4.12 41.94,68.45 41.94,56.04 v41.63,55.73 | J2.1 22.86,1.6 23.72,0.74 48.59,0.74 49.78,1.93 J5.1 49.78,5.36 48.51,6.63 48.51,38.25 44.98,41.78 44.98,49.35 v47.27,51.64
  Bottom 0.152: v47.27,51.64 45.57,51.64 41.63,55.58 v41.63,55.73
N$33
  Top 0.152: U$2.12 28.83,89.41 29.08,89.15 29.08,84.4 25.93,81.25 21.84,81.25 20.57,79.98 20.57,77.42 20.39,77.24 IC3.30
N$34
  Top 0.152: IC3.32 19.39,77.43 19.26,77.57 19.26,80.5 20.47,81.71 25.45,81.71 27.53,83.8 27.53,87.86 27.91,88.24 27.91,89.1 27.51,89.51 27.51,92.28 U$2.13
N$35
  Top 0.152: IC3.33 18.89,80.64 20.35,82.09 25.35,82.09 26.29,83.03 U$2.14
N$36
  Top 0.152: IC3.35 17.89,78.25 17.78,78.36 17.78,81.61 18.14,81.96 18.16,81.96 18.59,82.4 24.08,82.4 25.02,83.34 U$2.15
N$37
  Top 0.152: IC3.36 17.39,81.65 18.45,82.7 23.67,82.7 23.75,82.78 U$2.16
N$38
  Top 0.152: IC3.37 16.89,81.58 18.32,83.01 21.29,83.01 23.04,84.76 23.04,88.72 22.48,89.28 U$2.17
N$39
  Top 0.152: IC3.38 16.39,80.73 16.59,80.93 16.59,81.71 18.19,83.31 21.06,83.31 22.58,84.84 22.58,87.94 21.21,89.31 U$2.18
N$40
  Top 0.152: IC3.40 15.39,80.98 15.29,81.08 15.29,81.64 15.52,81.86 15.52,88.7 16.13,89.31 U$2.22
N$41
  Top 0.152: IC3.41 14.89,77.53 15.09,77.72 15.09,80.85 14.99,80.95 14.99,81.77 15.2,81.98 15.2,88.78 14.86,89.13 U$2.23
N$42  (via drill 0.35)
  Top 0.152: v21.49,79.96 21.49,79.93 20.89,79.34 IC3.29 | v16.13,88.39 16.13,87.38 v19.18,84.33
  Bottom 0.152: v21.49,79.96 21.49,83.08 20.24,84.33 v19.18,84.33 | U$2.47 v16.13,88.39
N$43  (via drill 0.35)
  Top 0.152: IC2.6 IC2.1 24.61,71.93 24.08,72.47 v24.08,72.72 | v18.69,87.45 19.66,86.49 v19.66,86.03 | IC3.27 | IC3.27 21.89,77.9 v22.3,78.31 22.61,78.61 25.3,78.61 25.4,78.51 v25.48,78.51
  Bottom 0.152: U$2.45 18.67,88.09 18.69,88.06 v18.69,87.45 | v19.66,86.03 22.3,83.39 v22.3,78.31 | v24.08,72.72 24.05,72.75 25.48,74.17 v25.48,78.51
N$44  (via drill 0.35)
  Top 0.152: v7.06,79.15 IC1.3
  Bottom 0.152: U$2.50 12.32,83.64 7.82,79.15 v7.06,79.15
N$45  (via drill 0.35)
  Top 0.152: v8.94,79.12 8.95,79.11 IC1.1
  Bottom 0.152: U$2.49 13.59,89.48 12.62,88.52 12.62,83.44 8.94,79.76 v8.94,79.12
N$46  (via drill 0.35)
  Top 0.152: v21.97,87.33 21.97,84.66 20.93,83.62 v17.04,83.62 | v10.34,78.54 9.88,78.08 9.88,73.74 9.58,73.43 9.22,73.43 8.95,73.7 IC1.6
  Bottom 0.152: U$2.42 22.48,88.49 21.87,87.88 21.87,87.43 v21.97,87.33 | v17.04,83.62 13.23,83.62 10.34,80.72 v10.34,78.54
N$47  (via drill 0.35)
  Top 0.152: IC4.11 41.41,63.69 41.53,63.57 41.53,58.95 41,58.42 41,55.02 v41.35,54.66 | J2.2 24.03,4.17 24.03,1.68 24.66,1.04 45.72,1.04 47.24,2.56 J5.2 45.95,6.63 45.95,39.83 44.35,41.43 44.35,50.86 v44.55,51.06
  Bottom 0.152: v41.35,54.66 41.35,54 44.3,51.06 v44.55,51.06
N$48  (via drill 0.35)
  Top 0.152: IC4.9 40.44,68.45 40.44,63.75 40.26,63.57 v40.26,54.84 | J2.4 24.33,8.94 24.33,1.83 24.79,1.37 43.99,1.37 44.7,2.08 J5.3 44.63,5.33 43.43,6.53 43.43,40.87 42.98,41.33 v42.98,49.71
  Bottom 0.152: v40.26,54.84 40.28,54.84 40.28,54.18 42.98,51.49 v42.98,49.71
N$49  (via drill 0.35)
  Top 0.152: IC4.8 39.91,67 40.05,66.86 40.05,63.93 39.88,63.76 39.88,63.17 39.57,62.87 39.57,53.75 v39.8,53.52 | J2.5 24.64,11.18 24.64,2.01 24.94,1.7 41.27,1.7 42.16,2.59 J5.4 40.87,6.63 v40.87,49.76
  Bottom 0.152: v39.8,53.52 40.87,52.45 v40.87,49.76
N$50  (via drill 0.35)
  Top 0.152: IC4.6 38.91,67.01 38.72,66.81 38.72,53.79 v38.36,53.43 | J2.6 24.94,13.41 24.94,2.16 25.09,2.01 38.48,2.01 39.62,3.15 J5.5 38.38,6.58 v38.38,49.73
  Bottom 0.152: v38.36,53.43 38.39,53.41 38.39,49.74 v38.38,49.73
N$51  (via drill 0.35)
  Top 0.152: IC4.5 38.41,60.01 35.79,57.38 v35.79,53.65 | J2.7 25.25,15.65 25.25,2.44 25.38,2.31 36.14,2.31 37.08,3.25 J5.6 35.81,6.6 v35.81,49.43
  Bottom 0.152: v35.79,53.65 35.79,49.43 v35.81,49.43
N$52  (via drill 0.35)
  Top 0.152: IC4.3 37.41,65.05 33.26,60.9 33.26,53.89 v33.15,53.77 | v33.15,49.89 33.15,23.24 v33.27,23.11 33.27,6.6 J5.7
  Bottom 0.152: v33.15,53.77 v33.15,49.89 | v33.27,23.11 J2.9
N$53  (via drill 0.35)
  Top 0.152: IC3.20 20.89,61.9 20.9,61.9 20.9,56.16 v19.86,55.12 | J1.7 7.87,18.03 18.21,7.7 18.21,6.71 v18.41,6.5
  Bottom 0.152: v19.86,55.12 18.14,55.12 15.21,52.2 15.21,25.63 7.62,18.03 J1.7 | v18.41,6.5 25.76,6.5 J5.10
N$54  (via drill 0.35)
  Top 0.152: IC3.19 20.39,66.96 20.59,66.76 20.59,61.94 v20.3,61.65 | v29.44,53.67 29.46,53.65 J3.9
  Bottom 0.152: J1.20 9.04,51.05 14.1,56.11 14.1,57.76 17.8,61.47 20.12,61.47 v20.3,61.65 24.79,61.65 29.44,57 v29.44,53.67
N$55  (via drill 0.35)
  Top 0.152: IC3.17 19.39,66.89 19.31,66.81 19.31,60.75 v19.53,60.53 | v9.96,48.23 10.03,48.31 v16.71,48.31
  Bottom 0.152: v19.53,60.53 17.5,60.53 14.4,57.43 14.4,55.96 6.96,48.51 | 6.96,48.51 | 6.96,48.51 J1.19 | 6.96,48.51 9.68,48.51 v9.96,48.23 | v16.71,48.31 18.64,48.31 19.68,47.27 41.3,47.27 45.11,43.46 45.11,41.76 48.03,38.84 49.76,38.84 51.41,37.19 51.41,8.99 50.29,7.87 J4.1
N$56  (via drill 0.35)
  Top 0.152: IC3.16 18.89,63.67 18.97,63.6 18.97,63.1 18.8,62.92 v18.8,59.61 | v16.79,44.78 v8.99,44.78
  Bottom 0.152: J1.17 7.64,43.43 v8.99,44.78 11.07,46.86 11.07,52.15 14.74,55.82 14.74,57.21 17.14,59.61 v18.8,59.61 | J4.2 48.56,9.2 48.56,22.05 50.8,24.28 50.8,34.57 40.69,44.68 16.89,44.68 v16.79,44.78
N$57  (via drill 0.35)
  Top 0.152: IC3.14 17.89,63.74 17.76,63.6 17.76,58.98 v18.01,58.73 | v45.19,26.75 45.19,37.08 45.03,37.24 45.03,39.45 v45.09,39.4 | v16.82,39.7 10.67,39.7 9.47,40.89 v9.14,40.89
  Bottom 0.152: J1.16 v9.14,40.89 11.76,43.51 11.76,52.4 15.07,55.72 15.07,57.11 16.69,58.73 v18.01,58.73 | J4.3 45.95,9.12 45.95,26.04 45.24,26.75 v45.19,26.75 | v45.09,39.4 45.05,39.4 44.8,39.65 16.87,39.65 v16.82,39.7
N$58  (via drill 0.35)
  Top 0.152: IC3.13 17.37,68.45 17.37,58.09 17.58,57.88 v17.58,57.58 | v9.47,38.35 14.86,38.35 18.41,34.8 18.67,34.8 v18.72,34.75 | v42.83,33.91 42.83,26.79 42.85,26.77 v42.83,26.75
  Bottom 0.152: J1.15 8.53,38.35 | v17.58,57.58 16.05,57.58 15.38,56.91 15.38,55.38 12.39,52.4 12.39,42.22 8.53,38.35 | 8.53,38.35 v9.47,38.35 | v18.72,34.75 18.9,34.57 42.37,34.57 42.83,34.11 v42.83,33.91 | v42.83,26.75 42.83,26.72 43.43,26.11 43.43,9.14 J4.4
N$59  (via drill 0.35)
  Top 0.152: IC3.12 16.92,68.45 16.92,58.4 16.69,58.17 v16.69,56.72 | v9.65,35.87 14.45,35.87 18.31,32 v18.41,32 | v40.26,26.7 v40.26,31.88
  Bottom 0.152: 8.46,35.81 13.16,40.51 13.16,52.55 15.68,55.08 15.68,56.49 15.91,56.72 v16.69,56.72 | J1.14 8.46,35.81 | 8.46,35.81 9.22,35.81 9.27,35.87 v9.65,35.87 | v18.41,32 40.21,32 40.26,31.95 v40.26,31.88 | v40.26,26.7 40.26,26.03 40.87,25.43 40.87,8.76 39.98,7.87 J4.5
N$60  (via drill 0.35)
  Top 0.152: IC3.11 16.39,63.79 16.56,63.62 16.56,62.86 15.98,62.28 15.98,55.85 v16.36,55.47 | v8.66,30.71 14.66,30.71 18.44,26.92 v18.47,26.92
  Bottom 0.152: 8.66,30.73 13.92,35.99 13.92,52.7 16.36,55.14 v16.36,55.47 | 8.66,30.73 J1.12 | 8.66,30.73 v8.66,30.71 | J4.6 38.41,9.2 38.41,25.7 37.19,26.92 v18.47,26.92
N$61  (via drill 0.35)
  Top 0.152: IC3.9 15.39,63.73 15.23,63.56 15.23,62.97 12.44,60.18 12.44,54.76 8.15,50.47 8.15,35.15 v9.12,34.19 9.2,34.11 13.03,34.11 17.6,29.54 v18.34,29.54 | v35.13,25.43 35.15,25.45 v35.15,29.49
  Bottom 0.152: v18.34,29.54 18.39,29.49 35.1,29.49 35.13,29.52 v35.15,29.49 | v35.13,25.43 35.13,25.4 35.84,24.69 35.84,9.14 34.57,7.87 J4.7 | v9.12,34.19 8.2,33.27 J1.13
N$62  (via drill 0.35)
  Top 0.152: IC3.8 14.89,67.02 15.01,66.91 15.01,64.46 14.93,64.38 14.93,63.1 11.92,60.09 11.92,54.77 7.75,50.6 7.75,46.79 6.93,45.97 | J1.18 6.93,45.97 | 6.93,45.97 7.11,45.8 7.11,28.73 13.92,21.92 v18.14,21.92
  Bottom 0.152: v18.14,21.92 18.21,21.92 18.24,21.89 31.55,21.89 33.25,20.19 33.25,9.12 J4.8
N$63  (via drill 0.35)
  Top 0.152: IC3.6 13.89,67.06 13.39,66.55 13.39,62.84 v13.18,62.64 | J2.18 26.09,45.97 28.19,43.87 | 28.19,43.87 28.19,8.79 29.11,7.87 J4.9 | v13.36,59.56 13.36,57.05 17.07,53.34 26.72,53.34 28.19,51.87 28.19,43.87
  Bottom 0.152: v13.18,62.64 13.18,59.59 13.21,59.56 v13.36,59.56
N$65  (via drill 0.35)
  Top 0.152: IC3.22 21.89,65.12 22.12,64.89 22.12,62.86 21.61,62.36 v21.61,57.68 | J1.9 5.79,23.11 v18.52,10.39
  Bottom 0.152: v21.61,57.68 20.17,57.68 14.83,52.34 14.83,32.87 J1.9 | v18.52,10.39 19.74,9.17 25.63,9.17 J4.10
N$70  (via drill 0.35)
  Top 0.152: IC3.23 22.39,65.05 22.43,65.02 22.43,60.56 22.43,60.55 22.43,59.73 v22.47,59.69 | J1.10 5.97,25.65 18.57,13.06 v18.57,12.78
  Bottom 0.152: v22.47,59.69 21.66,59.69 14.43,52.46 14.43,35 J1.10 | v18.57,12.78 19.61,11.73 25.6,11.73 J3.10
N$71  (via drill 0.35)
  Top 0.152: IC4.2 36.91,65.41 30.79,59.28 v30.79,25.65 30.79,6.53 31.98,5.33 J5.8
  Bottom 0.152: v30.79,25.65 J2.10

### Text on the board
tValues: 25 | 1 | FX-Devcart | Board Rev. A | Prototype by / David Shadoff / (c) 2024 | Top | Bottom | /WE /OE /CE | Gnd A17 A8 | D7 A16 A7 | D6 A15 A6 | D5 A14 A5 | D4 A13 A4 | D3 A12 A3 | D3 A12 A3 | D2 A11 A2 | D1 A10 A1 | D0 A9 A0
bValues: 50 | 26 | JLCJLCJLCJLC